# EAGLE design wt12_breakout_board_v20 (EAGLE 6.4)
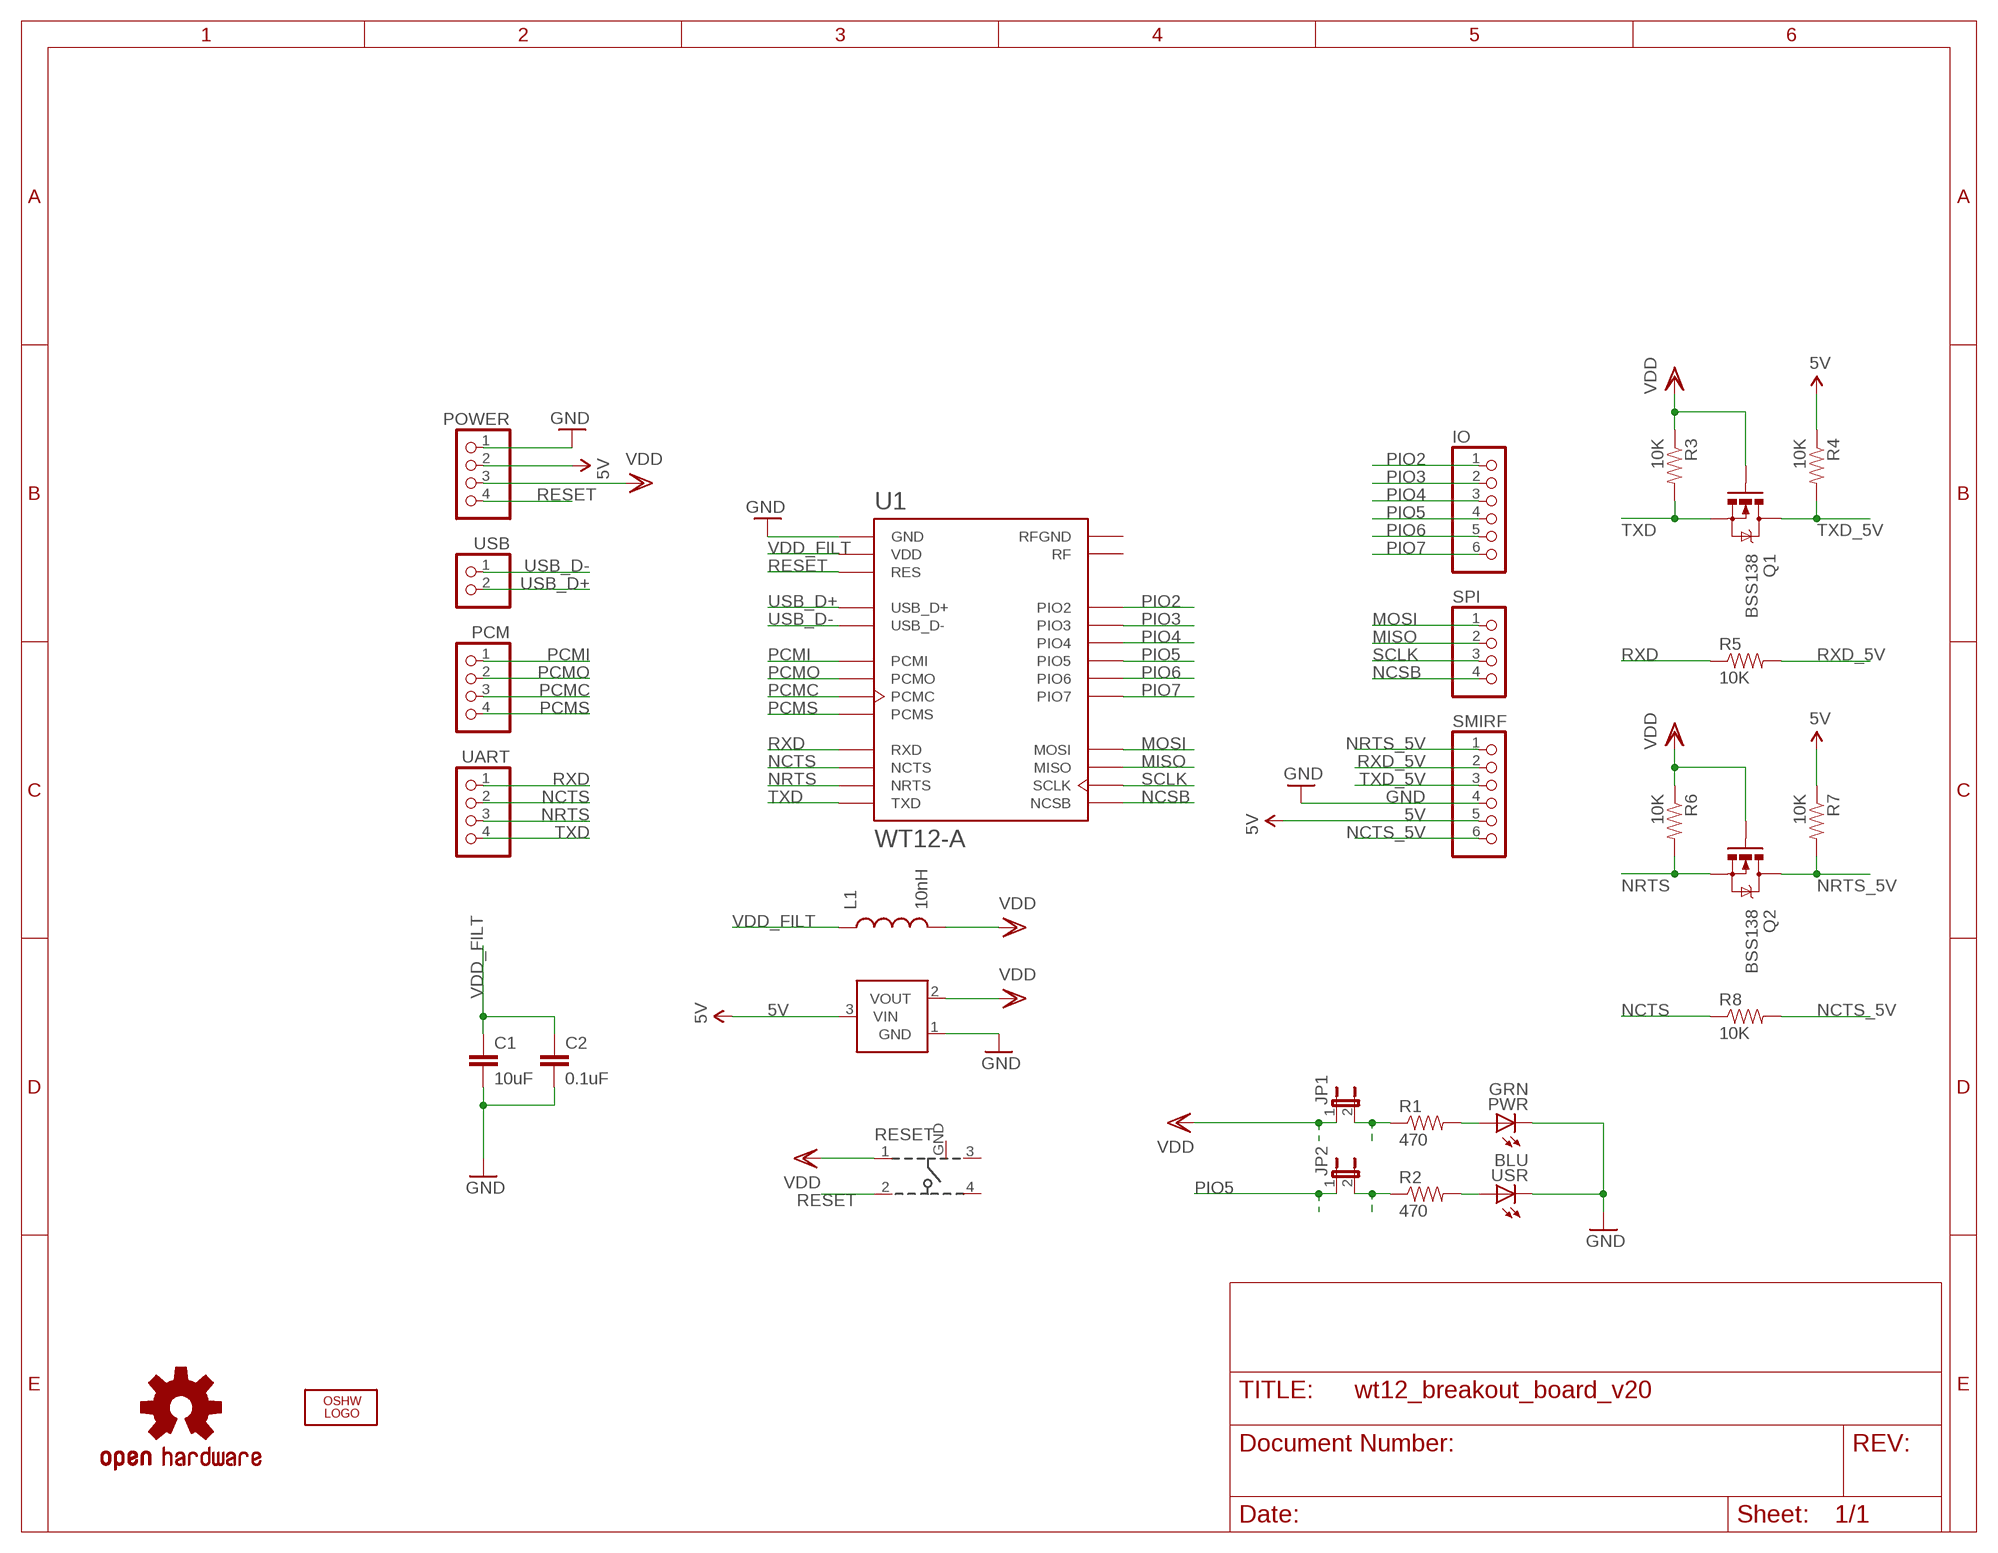
[diagram p0: schematic, sheet 1]

## Parts
C1  10uF  CAP0603-CAP  [0603-CAP]
C2  0.1uF  CAP0603-CAP  [0603-CAP]
IO  PINHD-1X6  [1X06]
JP1  JUMPER-2SMD-NC  [SJ_2S]
JP2  JUMPER-2SMD-NC  [SJ_2S]
L1  10nH  INDUCTOR0603  [0603]
LOGO1  OSHW_LOGO_FILLX0070-NT  [OSHW_FILLX70_NOTEXT]
PCM  PINHD-1X4  [1X04]
POWER  PINHD-1X4  [1X04]
PWR  GRN  LEDCHIPLED_0805  [CHIPLED_0805]
Q1  BSS138  MOSFET-NCHANNELSMD  [SOT23-3]
Q2  BSS138  MOSFET-NCHANNELSMD  [SOT23-3]
R1  470  RESISTOR0603-RES  [0603-RES]
R2  470  RESISTOR0603-RES  [0603-RES]
R3  10K  RESISTOR0603-RES  [0603-RES]
R4  10K  RESISTOR0603-RES  [0603-RES]
R5  10K  RESISTOR0603-RES  [0603-RES]
R6  10K  RESISTOR0603-RES  [0603-RES]
R7  10K  RESISTOR0603-RES  [0603-RES]
R8  10K  RESISTOR0603-RES  [0603-RES]
RESET  101-IG  [101-IG]
SMIRF  PINHD-1X6  [1X06]
SPI  PINHD-1X4  [1X04]
U1  WT12-A  [WT12-A]
U2  MCP1700  [SOT23-3]
U$5  OSHW-LOGOM  [OSHW-LOGO-M]
UART  PINHD-1X4  [1X04]
USB  PINHD-1X2  [1X02]
USR  BLU  LEDCHIPLED_0805  [CHIPLED_0805]

## Nets
5V [power]: POWER.2 R4.1 R7.1 SMIRF.5 U2.3(VIN)
GND [power]: C1.2 C2.2 POWER.1 PWR.C SMIRF.4 U1.GND U1.GND@2(GND) U1.GND@3(GND) U1.GND@4(GND) U2.1(GND) USR.C
MISO: SPI.2 U1.MISO
MOSI: SPI.1 U1.MOSI
N$1: PWR.A R1.2
N$3: R2.2 USR.A
N$4: JP2.2 R2.1
NCSB: SPI.4 U1.NCSB
NCTS: R8.1 U1.NCTS UART.2
NCTS_5V: R8.2 SMIRF.6
NRTS: Q2.2(S) R6.2 U1.NRTS UART.3
NRTS_5V: Q2.3(D) R7.2 SMIRF.1
PCMC: PCM.3 U1.PCMC
PCMI: PCM.1 U1.PCMI
PCMO: PCM.2 U1.PCMO
PCMS: PCM.4 U1.PCMS
PIO2: IO.1 U1.PIO2
PIO3: IO.2 U1.PIO3
PIO4: IO.3 U1.PIO4
PIO5: IO.4 JP2.1 U1.PIO5
PIO6: IO.5 U1.PIO6
PIO7: IO.6 U1.PIO7
RESET: POWER.4 RESET.2 U1.RES
RXD: R5.1 U1.RXD UART.1
RXD_5V: R5.2 SMIRF.2
SCLK: SPI.3 U1.SCLK
TXD: Q1.2(S) R3.2 U1.TXD UART.4
TXD_5V: Q1.3(D) R4.2 SMIRF.3
USB_D+: U1.USB_D+ USB.2
USB_D-: U1.USB_D- USB.1
VDD [power]: JP1.1 L1.2 POWER.3 Q1.1(G) Q2.1(G) R3.1 R6.1 RESET.1 U2.2(VOUT)
VDD_FILT [power]: C1.1 C2.1 L1.1 U1.VDD U1.VDD@2(VDD)
VDDJP1 [power]: JP1.2 R1.1
Unconnected: RESET.3 RESET.4 U1.RF U1.RFGND U1.RFGND@2(RFGND)

## Power pins joined to a net without a drawn wire
GND: RESET.GND

## Library data of the parts
C1 C2 = SparkFun:CAP: Capacitor Standard 0603 ceramic capacitor, and 0.1" leaded capacitor.
IO SMIRF = sf-pinhead:PINHD-1X6: PIN HEADER
JP1 JP2 = SparkFun:JUMPER-2: Jumper Basic 0.1" spaced jumper. Use with breakaway headers.
L1 = SparkFun:INDUCTOR: Inductors Basic Inductor/Choke - 0603 and 1206. Footprints are not proven and vary greatly between part numbers.
LOGO1 = oshw-logo:OSHW_LOGO_FILL
PCM POWER SPI UART = sf-pinhead:PINHD-1X4: PIN HEADER
PWR USR = adafruit:LED: LED OSRAM: - CHIPLED LG R971, LG N971, LY N971, LG Q971, LY Q971, LO R971, LY R971 LH N974, LH R974 LS Q976, LO Q976, LY Q976 LO Q996 - Hyper CHIPLED LW Q18S LB Q993, LB Q99A, LB R99A - SideLED LS A670, LO A670, LY A670, LG A670, LP A670 LB A673, LV A673, LT A673, LW A673 LH A674 LY A675 LS A676, LA A676, LO A676, LY A676, LW A676 LS A679, LY A679, LG A679 - Hyper Micro SIDELED® LS Y876, LA Y876, LO Y876, LY Y876 LT Y87S - SmartLED LW L88C, LW L88S LB L89C, LB L89S, LG L890 LS L89K, LO L89K, LY L89K LS L896, LA L896, LO L896, LY L896 - TOPLED LS T670, LO T670, LY T670, LG T670, LP T670 LSG T670, LSP T670, LSY T670, LOP T670, LYG T670 LG T671, LOG T671, LSG T671 LB T673, LV T673, LT T673, LW T673 LH T674 LS T676, LA T676, LO T676, LY T676, LB T676, LH T676, LSB T676, LW T676 LB T67C, LV T67C, LT T67C, LS T67K, LO T67K, LY T67K, LW E67C LS E67B, LA E67B, LO E67B, LY E67B, LB E67C, LV E67C, LT E67C LW T67C LS T679, LY T679, LG T679 LS T770, LO T770, LY T770, LG T770, LP T770 LB T773, LV T773, LT T773, LW T773 LH T774 LS E675, LA E675, LY E675, LS T675 LS T776, LA T776, LO T776, LY T776, LB T776 LHGB T686 LT T68C, LB T68C - Hyper Mini TOPLED® LB M676 - Mini TOPLED Santana® LG M470 LS M47K, LO M47K, LY M47K Source: http://www.osram.convergy.de/
Q1 Q2 = SparkFun:MOSFET-NCHANNEL
R1-R8 = SparkFun:RESISTOR: Resistor Basic schematic elements and footprints for 0603, 1206, and PTH resistors.
RESET = sf-keyglove:101-IG
U1 = sf-bluegiga:WT12-A: Class 2 Bluetooth 2.1 + EDR module, chip antenna and RF pins
U2 = nonolith:MCP1700: Voltage regulator
U$5 = SparkFun:OSHW-LOGO: Open Source Hardware Logo This logo indicates the piece of hardware it is found on incorporates a OSHW license and/or adheres to the definition of open source hardware found here: http://freedomdefined.org/OSHW
USB = sf-pinhead:PINHD-1X2: PIN HEADER

## Net classes
0 default: width 0.152 mm, drill 0.33 mm, clearance 0.152 mm
1 power: width 0.254 mm, drill 0.33 mm, clearance 0.152 mm

## Board
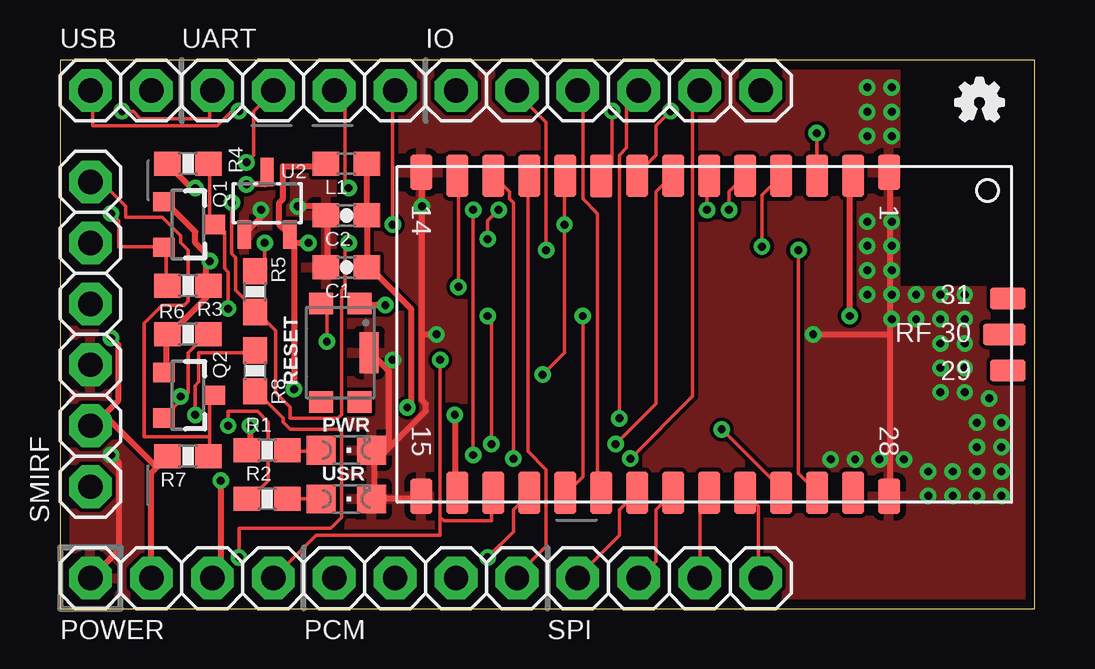
[diagram p1: board, top side]
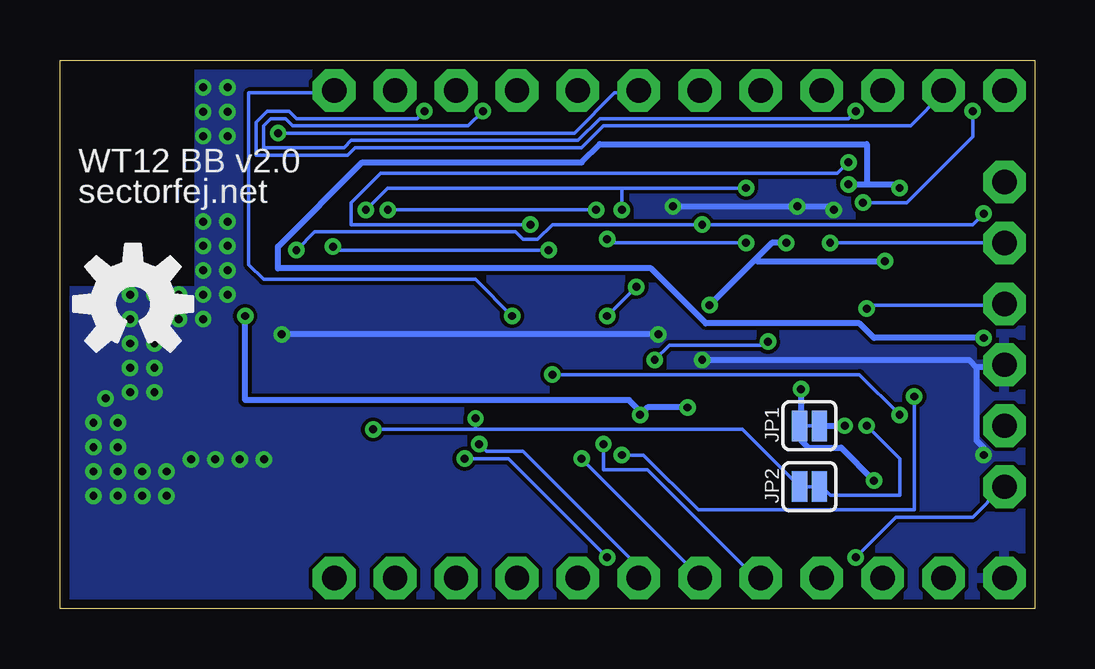
[diagram p2: board, bottom side, seen from below]

Size 40.64 x 22.86 mm. Coordinates in mm from the lower left corner, seen from the top.
Outline: 0,0 40.64,0 40.64,22.86 0,22.86 0,0
Copper layers (1*16): Top 0.0356mm / dielectric 1.5011mm / Bottom 0.0356mm
Design rules "LaenPCBOrder *": minimum track width 6mil, minimum drill 13mil, track to track 6mil, track to pad 6mil, pad to pad 6mil, via to via 6mil, smd to smd 6mil, copper to edge 15mil, drill to drill 6mil, minimum pad ring 7mil, minimum via ring 7mil, stop-mask expansion 4mil, vias tented up to drill 13mil, thermal gap 10mil
tRestrict: area 35.1,13.5 to 40.6,22.9
bRestrict: area 35.1,13.5 to 40.6,22.9
vRestrict: area 0,19.3 to 30.5,20.3; area 0,2.5 to 30.5,3.6; area 2.5,3.8 to 3.8,19.1; area 10.9,5.3 to 12.4,5.8; area 10.9,7.4 to 12.4,7.9

### Footprints (pad centres in the part's own frame; a part is rotated, then mirrored left to right if it is on the bottom)
0603-CAP = smd 1.1 x 1: 1 -0.85,0; 2 0.85,0
1X06 = drill 1.016 pad 1.778 octagon: 1 -6.35,0; 2 -3.81,0; 3 -1.27,0; 4 1.27,0; 5 3.81,0; 6 6.35,0
SJ_2S = smd 0.635 x 1.27: 1 -0.412,0; 2 0.412,0
0603 = smd 1.1 x 1: 1 -0.85,0; 2 0.85,0
1X04 = drill 1.016 pad 1.778 octagon: 1 -3.81,0; 2 -1.27,0; 3 1.27,0; 4 3.81,0
CHIPLED_0805 = smd 1.2 x 1.2: A 0,-1.05; C 0,1.05
SOT23-3 = smd 0.8 x 0.9: 1 -0.95,-1; 2 0.95,-1; 3 0,1.1
0603-RES = smd 1.1 x 1: 1 -0.85,0; 2 0.85,0
101-IG = smd 0.9 x 1: 1 -2.05,0.8; 2 -2.05,-0.8; 3 2.05,0.8; 4 2.05,-0.8 | smd 1.7 x 0.8: GND 0,1.2
WT12-A = smd 1.478 x 0.914: GND -6.75,7.7; GND@2 -6.75,-11.8; GND@3 6.75,-11.8; GND@4 6.75,7.7 | smd 1.778 x 0.914: MISO 6.6,0.2; MOSI 6.6,1.7; NC 6.6,6.2; NCSB 6.6,-2.8; NCTS -6.6,-5.8; NRTS -6.6,1.7; PCMC -6.6,-8.8; PCMI -6.6,-7.3; PCMO -6.6,-1.3; PCMS -6.6,-10.3; PIO2 -6.6,4.7; PIO3 -6.6,3.2; PIO4 6.6,-4.3; PIO5 6.6,3.2; PIO6 6.6,-7.3; PIO7 6.6,-5.8; RES 6.6,-8.8; RXD -6.6,0.2; SCLK 6.6,-1.3; TXD 6.6,4.7; USB_D+ -6.6,-2.8; USB_D- -6.6,-4.3; VDD -6.6,6.2; VDD@2 6.6,-10.3 | smd 0.914 x 1.778: RF 0,12.5 | smd 0.914 x 1.478: RFGND 1.5,12.65; RFGND@2 -1.5,12.65
SOT23-3' = smd 0.55 x 1.2: 1 0.95,1.3; 2 -0.95,1.3; 3 0,-1.3
1X02 = drill 1.016 pad 1.778 octagon: 1 -1.27,0; 2 1.27,0

### Placement (x,y rotation side)
C1  11.94,14.22 180 top
C2  11.94,16.38 180 top
IO  22.86,21.59 0 top
JP1  9.4,7.62 0 bottom
JP2  9.4,5.08 0 bottom
L1  11.94,18.54 180 top
LOGO1  37.34,20.32 0 top
PCM  15.24,1.27 180 top
POWER  5.08,1.27 0 top
PWR  11.94,6.6 270 top
Q1  5.33,16 270 top
Q2  5.33,8.89 270 top
R1  8.64,6.6 0 top
R2  8.64,4.57 0 top
R3  5.33,13.46 180 top
R4  5.33,18.54 0 top
R5  8.13,13.21 90 top
R6  5.33,11.43 0 top
R7  5.33,6.35 0 top
R8  8.13,9.91 270 top
RESET  11.68,10.67 270 top
SMIRF  1.27,11.43 270 top
SPI  25.4,1.27 180 top
U1  26.86,11.43 270 top
U2  MCP1700  [SOT23-3']  8.64,16.89 180 top
U$5  37.59,12.7 0 bottom
UART  10.16,21.59 0 top
USB  2.54,21.59 0 top
USR  11.94,4.57 270 top

### Tracks (layer width: path | path; a pad name or v marks a point on that pad's centre or on a via)
5V  (via drill 0.33)
  Top 0.254: POWER.2 3.81,5.64 4.42,6.25 R7.1 3.96,5.94 1.98,7.92 1.98,8.08 SMIRF.5 1.37,7.62 2.44,8.69 2.44,10.97 v2.13,11.28 | v5.64,17.53 5.49,17.53 4.57,18.44 R4.1 | v7.77,17.68 8.53,17.68 8.53,18.14 U2.3
  Bottom 0.254: v5.64,17.53 5.79,17.68 7.01,17.68 | v7.77,17.68 7.01,17.68 | 7.01,17.68 7.01,19.36 18.14,19.36 18.9,18.59 28.04,18.59 31.55,15.09 31.55,14.17 16,14.17 13.72,11.89 7.32,11.89 6.71,11.28 v2.13,11.28
GND  (via drill 0.33)
  Top 0.254: POWER.1 2.44,2.44 2.44,6.1 v2.13,6.4 | 34.59,11.43 34.59,18.14 U1.GND 34.59,18.29 | 34.59,11.43 34.59,4.72 U1.GND@4 | C1.2 11.12,14.33 11.12,16.31 C2.2 10.97,16.46 10.97,16.76 v9.91,16.76 | v8.38,16.61 8.38,16.31 7.77,15.7 U2.1 | 15.09,18.29 U1.GND@2 15.09,18.14 v15.09,16.76 15.09,11.43 | 13.11,4.57 14.94,4.57 U1.GND@3 15.09,4.72 | 13.11,4.57 13.11,6.1 | 13.11,6.1 13.11,6.55 PWR.C 13.11,6.1 | 13.11,4.57 USR.C | 15.09,11.43 15.09,8.69 15.24,8.53 15.24,8.23 13.79,6.78 | 13.11,6.1 13.79,6.78 | 13.64,9.98 13.72,9.91 13.72,6.86 13.79,6.78 | 13.64,9.98 12.95,10.67 RESET.GND | v31.39,11.43 34.59,11.43 | 15.09,11.43 v15.7,11.43 | v13.87,10.36 13.72,10.21 13.72,10.06 13.64,9.98
  Bottom 0.254: v2.13,6.4 2.13,6.71 2.44,7.01 2.44,10.06 | 2.44,10.06 1.37,10.06 SMIRF.4 | v8.38,16.61 8.53,16.76 v9.91,16.76 v15.09,16.76 | v15.7,11.43 v31.39,11.43 | 2.44,10.06 2.74,10.36 v13.87,10.36
  other vias: 34.67,14.1 33.66,14.1 34.67,13.08 35.69,13.08 36.7,13.08 37.72,13.08 37.72,12.06 37.72,11.05 37.72,10.03 37.72,9.02 38.73,8.76 39.24,7.75 36.7,12.06 35.69,12.06 34.67,12.06 33.66,13.08 33.66,15.11 33.66,16.13 34.67,16.13 34.67,15.11 34.67,19.68 34.67,20.7 34.67,21.72 33.66,21.72 33.66,20.7 33.66,19.68 39.24,6.73 39.24,5.71 39.24,4.7 38.23,4.7 37.21,4.7 36.2,4.7 36.2,5.71 37.21,5.71 38.23,5.71 38.23,6.73 38.23,7.75 36.7,11.05 36.7,10.03 36.7,9.02 35.18,6.22 34.16,6.22 33.15,6.22 32.13,6.22
  pour Top: 0,22.86 40.64,22.86 40.64,0 0,0
  pour Bottom: 0,22.86 40.64,22.86 40.64,0 0,0
MISO
  Top 0.152: SPI.2 26.67,4.42 26.98,4.72 U1.MISO
MOSI
  Top 0.152: U1.MOSI 28.65,4.72 29.11,4.27 29.11,1.37 SPI.1
N$1
  Top 0.152: R1.2 9.6,6.55 10.82,6.55 PWR.A
N$3
  Top 0.152: USR.A R2.2
N$4  (via drill 0.33)
  Top 0.152: v7.01,7.62 7.01,8.23 8.23,8.23 8.69,7.77 8.69,5.33 7.92,4.57 R2.1
  Bottom 0.152: v7.01,7.62 5.64,6.25 5.64,4.72 8.53,4.72 8.84,5.03 JP2.2
N$5
  Bottom 0.152: 9.14,5.08 9.65,5.08
N$6
  Bottom 0.152: 9.14,7.62 9.65,7.62
NCSB
  Top 0.152: U1.NCSB 23.93,4.72 23.32,4.12 23.32,3.05 21.64,1.37 SPI.4
NCTS  (via drill 0.33)
  Top 0.152: v5.64,8.08 5.64,9.3 5.79,9.45 5.79,10.67 8.08,10.67 R8.1 | v20.12,9.75 21.03,10.67 v21.03,16 21.03,17.98 U1.NCTS | v7.77,18.59 8.08,18.9 8.08,20.73 8.84,21.49 UART.2
  Bottom 0.152: v5.64,8.08 7.32,9.75 v20.12,9.75 | v7.77,18.59 8.23,18.14 27.28,18.14 28.5,16.92 28.5,16 v21.03,16
NCTS_5V  (via drill 0.33)
  Top 0.152: v7.47,2.13 7.47,3.35 11.28,3.35 11.73,3.81 11.73,7.47 9.6,7.47 9.3,7.77 9.3,7.92 8.23,8.99 R8.2
  Bottom 0.152: v7.47,2.13 5.79,3.81 2.59,3.81 1.37,5.03 SMIRF.6
NRTS  (via drill 0.33)
  Top 0.152: 5.03,8.69 5.33,8.99 5.33,10.67 6.1,11.43 R6.2 | 5.03,8.69 4.42,8.08 Q2.2 | v27.89,16.61 27.89,17.37 28.5,17.98 U1.NRTS | v12.04,17.53 11.89,17.68 11.89,21.03 11.43,21.49 UART.3 | v5.03,8.84 5.03,8.69 | v17.22,16.61 v17.22,6.4
  Bottom 0.152: v27.89,16.61 26.98,17.53 17.22,17.53 | v12.04,17.53 17.22,17.53 | v5.03,8.84 5.03,4.12 14.02,4.12 16.31,6.4 v17.22,6.4 | 17.22,17.53 v17.22,16.61
NRTS_5V
  Top 0.152: 6.25,7.16 6.25,6.4 R7.2 | 6.25,7.16 6.25,8.69 6.4,8.84 Q2.3 | 6.25,7.16 3.5,7.16 3.5,11.89 4.27,12.65 5.18,12.65 5.33,12.8 5.33,14.94 5.03,15.24 5.03,15.54 4.27,16.31 2.74,16.31 2.74,16.76 1.83,17.68 1.37,17.68 SMIRF.1
PCMC  (via drill 0.33)
  Top 0.152: v18.9,6.25 18.9,16.92 18.75,17.07 18.75,17.37 18.14,17.98 U1.PCMC
  Bottom 0.152: v18.9,6.25 14.02,1.37 PCM.3
PCMI
  Top 0.152: U1.PCMI 19.51,17.98 19.51,6.55 20.27,5.79 20.27,2.59 19.05,1.37 PCM.1
PCMO  (via drill 0.33)
  Top 0.152: v23.16,6.86 24.84,8.53 24.84,17.37 25.45,17.98 U1.PCMO
  Bottom 0.152: v23.16,6.86 22.86,6.55 21.34,6.55 16.61,1.83 16.61,1.37 PCM.2
PCMS  (via drill 0.33)
  Top 0.152: v16.61,13.41 16.61,17.98 U1.PCMS | v17.83,12.19 17.98,12.04 v17.98,6.86
  Bottom 0.152: v17.83,12.19 v16.61,13.41 | v17.98,6.86 17.98,5.79 16.15,5.79 11.73,1.37 11.43,1.37 PCM.4
PIO2  (via drill 0.33)
  Top 0.152: v31.55,19.81 31.55,18.14 U1.PIO2
  Bottom 0.152: v31.55,19.81 19.2,19.81 17.53,21.49 16.61,21.49 IO.1
PIO3  (via drill 0.33)
  Top 0.152: v29.26,15.09 29.26,17.22 30.02,17.98 U1.PIO3 | v20.27,14.94 20.27,20.27 19.05,21.49 IO.2
  Bottom 0.152: v29.26,15.09 29.11,14.94 v20.27,14.94
PIO4
  Top 0.152: U1.PIO4 22.55,4.88 22.4,5.03 22.4,16.46 21.79,17.07 21.79,21.34 21.64,21.49 IO.3
PIO5  (via drill 0.33)
  Top 0.152: v27.58,7.47 30.02,5.03 30.02,4.88 U1.PIO5 | v23.32,7.92 23.32,18.9 23.62,19.2 23.62,21.03 24.08,21.49 IO.4
  Bottom 0.152: v27.58,7.47 23.32,7.47 | 23.32,7.47 12.19,7.47 9.91,5.18 JP2.1 | 23.32,7.47 v23.32,7.92
PIO6  (via drill 0.33)
  Top 0.152: v17.83,2.13 18.9,3.2 18.9,4.12 19.51,4.72 U1.PIO6 | v23.77,6.25 26.36,8.84 26.36,21.18 26.67,21.49 IO.5
  Bottom 0.152: v17.83,2.13 21.95,6.25 v23.77,6.25
PIO7  (via drill 0.33)
  Top 0.152: v21.79,12.19 21.79,5.49 21.18,4.88 U1.PIO7
  Bottom 0.152: v21.79,12.19 23.32,13.72 32.16,13.72 32.77,14.33 32.77,21.49 29.26,21.49 IO.6
RESET  (via drill 0.33)
  Top 0.152: v11.12,11.12 11.12,12.5 10.97,12.65 RESET.2 | 15.85,3.81 v15.85,10.36 | 15.85,3.81 16,3.66 17.98,3.66 17.98,4.72 U1.RES | POWER.4 10.67,3.05 15.85,3.05 15.85,3.81
  Bottom 0.152: v11.12,11.12 11.28,10.97 15.24,10.97 v15.85,10.36
RXD  (via drill 0.33)
  Top 0.152: v7.16,16.92 7.16,14.78 7.32,14.63 7.32,13.26 8.08,12.5 R5.1 8.23,12.34 8.99,11.58 8.99,8.99 9.6,8.38 9.6,7.92 11.58,7.92 11.73,8.08 11.73,13.26 11.89,13.41 11.89,15.09 v12.04,15.24 | v2.59,20.73 3.05,20.73 3.35,20.42 6.25,20.42 6.25,21.49 UART.1 | v26.98,16.61 26.98,17.98 U1.RXD | v18.29,16.61 17.83,16.15 v17.83,15.39
  Bottom 0.152: v7.16,16.92 5.33,16.92 2.59,19.66 v2.59,20.73 | v18.29,16.61 v26.98,16.61 | v17.83,15.39 17.68,15.24 v12.04,15.24
RXD_5V  (via drill 0.33)
  Top 0.152: v8.53,15.24 8.53,14.48 8.23,14.17 R5.2
  Bottom 0.152: SMIRF.2 v8.53,15.24
SCLK
  Top 0.152: SPI.3 24.84,1.98 24.84,4.12 25.45,4.72 U1.SCLK
TXD  (via drill 0.33)
  Top 0.152: R3.2 4.42,13.56 4.42,14.94 Q1.2 4.27,15.09 2.44,15.09 2.44,16.15 v2.13,16.46 | v13.87,16 13.87,21.49 UART.4 | v30.79,14.94 30.79,5.64 31.55,4.88 U1.TXD
  Bottom 0.152: v2.13,16.46 2.59,16 v13.87,16 20.12,16 20.73,15.39 21.34,15.39 21.64,15.7 30.02,15.7 v30.79,14.94
TXD_5V  (via drill 0.33)
  Top 0.152: R4.2 6.25,18.44 6.25,16.15 6.4,16 Q1.3 6.55,16 6.86,15.7 6.86,14.17 7.01,14.02 v7.01,12.5
  Bottom 0.152: v7.01,12.5 6.86,12.65 1.37,12.65 SMIRF.3
USB_D+  (via drill 0.33)
  Top 0.152: v25.45,20.73 24.84,20.12 24.84,18.9 24.08,18.14 U1.USB_D+
  Bottom 0.152: v25.45,20.73 25.76,20.42 30.79,20.42 31.09,20.73 32,20.73 32.46,20.27 32.46,18.9 28.65,18.9 28.35,19.2 18.9,19.2 17.98,20.12 5.18,20.12 3.81,21.49 USB.2
USB_D-  (via drill 0.33)
  Top 0.152: v23.01,20.73 23.01,18.44 22.71,18.14 U1.USB_D- | v7.47,20.73 7.16,20.73 6.55,20.12 1.37,20.12 1.37,21.49 USB.1
  Bottom 0.152: v23.01,20.73 23.62,20.12 30.94,20.12 31.24,20.42 31.85,20.42 32.16,20.12 32.16,19.2 28.8,19.2 28.5,19.51 19.05,19.51 18.14,20.42 7.77,20.42 v7.47,20.73
VDD  (via drill 0.33)
  Top 0.254: Q2.1 4.42,9.91 4.42,11.43 R6.1 4.57,11.43 6.1,12.95 6.1,13.41 R3.1 6.1,13.56 6.1,14.48 | 6.1,14.48 6.1,14.78 5.64,15.24 5.64,15.7 4.42,16.92 Q1.1 | v13.56,12.65 12.5,12.65 RESET.1 | 9.75,15.24 9.6,15.24 9.6,15.54 U2.2 | 9.75,15.24 v10.36,15.24 | L1.2 10.97,18.44 9.3,18.44 9.3,17.07 9.14,16.92 9.14,16 9.45,15.7 U2.2 | 9.75,15.24 v9.75,9.14 | 9.75,15.24 U2.2 | v6.71,5.33 6.71,1.68 6.4,1.37 POWER.3 | v6.25,14.48 6.1,14.48
  Bottom 0.254: 11.66,14.55 10.97,15.24 v10.36,15.24 | 11.66,14.55 v13.56,12.65 | v9.75,9.14 9.75,7.62 | v6.71,5.33 8.08,6.71 9.45,6.71 9.75,7.01 9.75,7.62 | 9.75,7.62 JP1.1 | v6.25,14.48 11.58,14.48 11.66,14.55
VDD_FILT  (via drill 0.33)
  Top 0.254: 12.8,14.33 12.8,16.31 C2.1 12.8,16.46 12.8,18.44 L1.1 | v16.46,8.08 16.46,4.88 U1.VDD@2 | v14.48,8.38 14.63,8.53 14.63,12.5 12.8,14.33 | 12.8,14.33 C1.1 | v32.92,12.19 32.92,17.98 U1.VDD
  Bottom 0.254: v14.48,8.38 16.15,8.38 v16.46,8.08 16.46,8.23 16.92,8.69 32.92,8.69 v32.92,12.19
VDDJP1  (via drill 0.33)
  Top 0.254: v7.92,7.62 7.92,6.71 R1.1
  Bottom 0.254: JP1.2 v7.92,7.62

### Text on the board
bPlace: WT12 BB v2.0 | sectorfej.net
tDocu: D- D+ | RTS RXD TXD GND VCC CTS | RXD CTS RTS TXD | P2 P3 P4 P5 P6 P7 | Bluegiga / WT12-A | GND 3V3 RES SYN CLK OUT CSB SCK | 5V | IN | MISO | MOSI
bDocu: PWR | PIO5